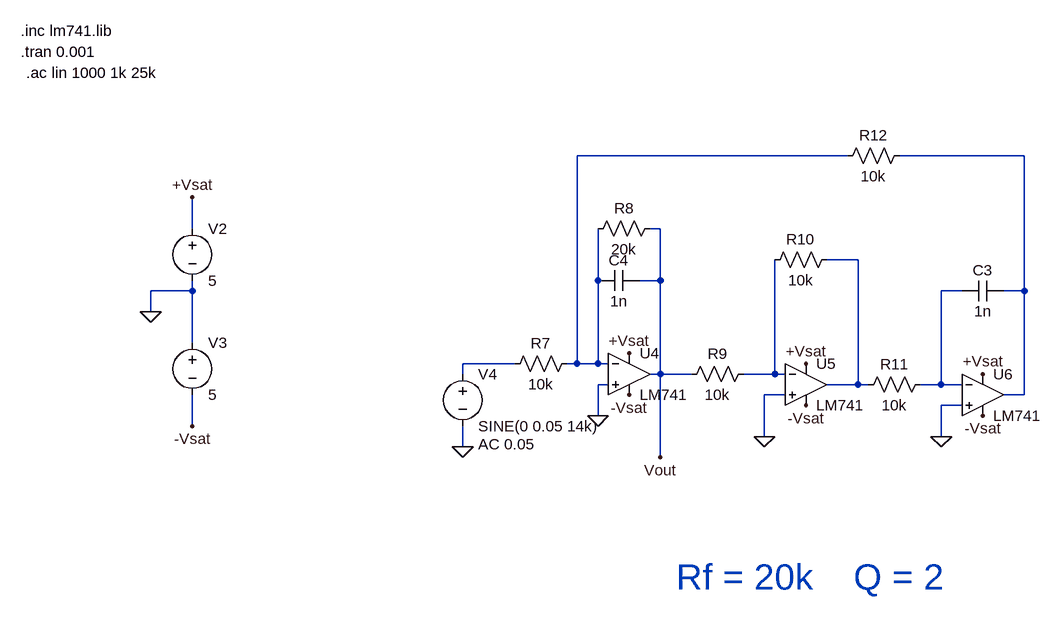
[diagram p0: schematic bandpass_filter_q_2.asc]
bandpass_filter_q_2.asc, the LTspice schematic file:
Version 4
SHEET 1 1824 680
WIRE 1520 -112 1104 -112
WIRE 1792 -112 1600 -112
WIRE 512 0 512 -48
WIRE 1232 0 1216 0
WIRE 1536 48 1488 48
WIRE 1136 80 1136 0
WIRE 1232 80 1232 0
WIRE 1232 80 1200 80
WIRE 512 96 512 80
WIRE 512 96 448 96
WIRE 1696 96 1664 96
WIRE 1792 96 1792 -112
WIRE 1792 96 1760 96
WIRE 448 128 448 96
WIRE 512 176 512 96
WIRE 1008 208 928 208
WIRE 1104 208 1104 -112
WIRE 1104 208 1088 208
WIRE 1136 208 1136 80
WIRE 1136 208 1104 208
WIRE 1152 208 1136 208
WIRE 928 224 928 208
WIRE 1232 224 1232 80
WIRE 1232 224 1216 224
WIRE 1280 224 1232 224
WIRE 1408 224 1408 48
WIRE 1408 224 1360 224
WIRE 1424 224 1408 224
WIRE 1152 240 1136 240
WIRE 1536 240 1536 48
WIRE 1536 240 1488 240
WIRE 1552 240 1536 240
WIRE 1664 240 1664 96
WIRE 1664 240 1632 240
WIRE 1696 240 1664 240
WIRE 1424 256 1392 256
WIRE 1792 256 1792 96
WIRE 1792 256 1760 256
WIRE 1696 272 1664 272
WIRE 1136 288 1136 240
WIRE 512 304 512 256
WIRE 1392 320 1392 256
WIRE 1664 320 1664 272
WIRE 928 336 928 304
WIRE 1232 352 1232 224
FLAG 448 128 0
FLAG 512 -48 +Vsat
FLAG 512 304 -Vsat
FLAG 1664 320 0
FLAG 1392 320 0
FLAG 1136 288 0
FLAG 928 336 0
FLAG 1184 192 +Vsat
FLAG 1456 208 +Vsat
FLAG 1728 224 +Vsat
FLAG 1184 256 -Vsat
FLAG 1456 272 -Vsat
FLAG 1728 288 -Vsat
FLAG 1232 352 Vout
SYMBOL voltage 512 -16 R0
WINDOW 123 0 0 Left 0
WINDOW 39 0 0 Left 0
SYMATTR InstName V2
SYMATTR Value 5
SYMBOL voltage 512 160 R0
WINDOW 123 0 0 Left 0
WINDOW 39 0 0 Left 0
SYMATTR InstName V3
SYMATTR Value 5
SYMBOL OpAmps\\opamp2 1184 160 R0
SYMATTR InstName U4
SYMATTR Value LM741
SYMBOL OpAmps\\opamp2 1456 176 R0
SYMATTR InstName U5
SYMATTR Value LM741
SYMBOL OpAmps\\opamp2 1728 192 R0
SYMATTR InstName U6
SYMATTR Value LM741
SYMBOL res 1104 192 R90
WINDOW 0 0 56 VBottom 2
WINDOW 3 32 56 VTop 2
SYMATTR InstName R7
SYMATTR Value 10k
SYMBOL res 1232 -16 R90
WINDOW 0 0 56 VBottom 2
WINDOW 3 32 56 VTop 2
SYMATTR InstName R8
SYMATTR Value 20k
SYMBOL res 1376 208 R90
WINDOW 0 0 56 VBottom 2
WINDOW 3 32 56 VTop 2
SYMATTR InstName R9
SYMATTR Value 10k
SYMBOL res 1504 32 R90
WINDOW 0 0 56 VBottom 2
WINDOW 3 32 56 VTop 2
SYMATTR InstName R10
SYMATTR Value 10k
SYMBOL res 1648 224 R90
WINDOW 0 0 56 VBottom 2
WINDOW 3 32 56 VTop 2
SYMATTR InstName R11
SYMATTR Value 10k
SYMBOL res 1616 -128 R90
WINDOW 0 0 56 VBottom 2
WINDOW 3 32 56 VTop 2
SYMATTR InstName R12
SYMATTR Value 10k
SYMBOL cap 1760 80 R90
WINDOW 0 0 32 VBottom 2
WINDOW 3 32 32 VTop 2
SYMATTR InstName C3
SYMATTR Value 1n
SYMBOL cap 1200 64 R90
WINDOW 0 0 32 VBottom 2
WINDOW 3 32 32 VTop 2
SYMATTR InstName C4
SYMATTR Value 1n
SYMBOL voltage 928 208 R0
WINDOW 123 24 124 Left 2
WINDOW 39 0 0 Left 0
SYMATTR Value2 AC 0.05
SYMATTR InstName V4
SYMATTR Value SINE(0 0.05 14k)
TEXT 248 -272 Left 2 !.tran 0.001
TEXT 248 -304 Left 2 !.inc lm741.lib
TEXT 256 -240 Left 2 !.ac lin 1000 1k 25k
TEXT 1256 536 Left 5 ;Rf = 20k    Q = 2

The netlist it stands for:
* bandpass_filter_q_2.asc
V2 +Vsat 0 5
V3 0 -Vsat 5
XU4 0 N001 +Vsat -Vsat Vout LM741  ; pins In+ In- V+ V- OUT
XU5 0 N006 +Vsat -Vsat N003 LM741  ; pins In+ In- V+ V- OUT
XU6 0 N004 +Vsat -Vsat N002 LM741  ; pins In+ In- V+ V- OUT
R7 N001 N005 10k
R8 Vout N001 20k
R9 N006 Vout 10k
R10 N003 N006 10k
R11 N004 N003 10k
R12 N002 N001 10k
C3 N002 N004 1n
C4 Vout N001 1n
V4 N005 0 SINE(0 0.05 14k) AC 0.05
.tran 0.001
.inc lm741.lib
.ac lin 1000 1k 25k
* Rf = 20k    Q = 2
.backanno
.end